# Altium schematic sheet 1_Battery.SchDoc
size A
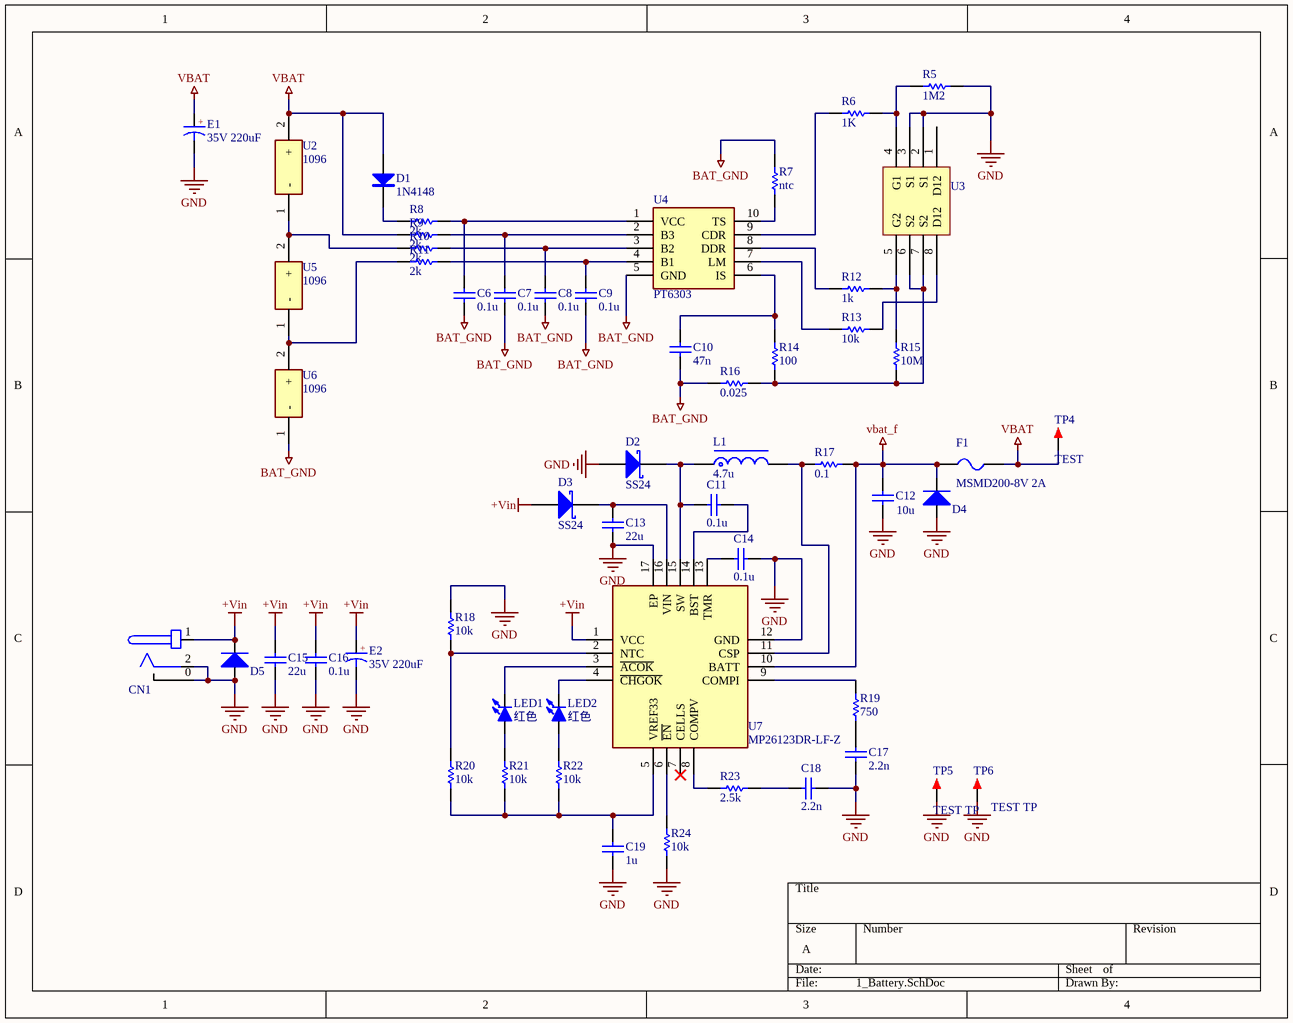
[diagram p0: 1_Battery.SchDoc]

## Parts
C6  0.1u  [CAP_0603_SMD]
C7  0.1u  [CAP_0603_SMD]
C8  0.1u  [CAP_0603_SMD]
C9  0.1u  [CAP_0603_SMD]
C10  47n  [CAP_0603_SMD]
C11  0.1u  [CAP_0603_SMD]
C12  10u  [C1206_L]
C13  22u  [C1812_L]
C14  0.1u  [CAP_0603_SMD]
C15  22u  [C1812_L]
C16  0.1u  [CAP_0603_SMD]
C17  2.2n  [CAP_0603_SMD]
C18  2.2n  [CAP_0603_SMD]
C19  1u  [CAP_0603_SMD]
CN1  PWR5.5x2.1_HP  [PWR5.5x2.1_HP]  (value not drawn)
D1  1N4148  [SOD-323]
D2  SS24  [SMB]
D3  SS24  [SMB]
D4  TVS  [SMA]  (value not drawn)
D5  TVS  [SMA]  (value not drawn)
E1  35V 220uF  [CE E(8*10.2)]
E2  35V 220uF  [CE E(8*10.2)]
F1  MSMD200-8V 2A  [FU 1812]
L1  4.7u  [L-SMD-0630]
LED1  红色  [LED0603_Y]
LED2  红色  [LED0603_Y]
R5  1M2  [RES_0603_SMD]
R6  1K  [RES_0603_SMD]
R7  ntc  [RES_0603_SMD]
R8  2k  [RES_0603_SMD]
R9  2k  [RES_0603_SMD]
R10  2k  [RES_0603_SMD]
R11  2k  [RES_0603_SMD]
R12  1k  [RES_0603_SMD]
R13  10k  [RES_0603_SMD]
R14  100  [RES_0603_SMD]
R15  10M  [RES_0603_SMD]
R16  0.025  [RES_1206_SMD]
R17  0.1  [RES_1206_SMD]
R18  10k  [RES_0603_SMD]
R19  750  [RES_0603_SMD]
R20  10k  [RES_0603_SMD]
R21  10k  [RES_0603_SMD]
R22  10k  [RES_0603_SMD]
R23  2.5k  [RES_0603_SMD]
R24  10k  [RES_0603_SMD]
TP4  TEST  [TEST 1.2]
TP5  TEST TP  [TEST TP1.4_BK]
TP6  TEST TP  [TEST TP1.4_BK]
U2  1096  [1096]
U3  FS8205A TSSOP-8  [IC_TSSOP-8]  (value not drawn)
U4  PT6303  [SOP50P490X110-10N]
U5  1096  [1096]
U6  1096  [1096]
U7  MP26123DR-LF-Z  [QFN65P400X400X100-17N-D]

## Nets
+Vin: C15.2 C16.2 CN1.1(+) D3.1(A) D5.2(K) E2.1 U7.1(VCC)
BAT_GND: C6.2 C7.2 C8.2 C9.2 C10.2 R7.1 R16.1 U4.5(GND) U6.1(-)
GND: C12.1 C13.1 C14.2 C15.1 C16.1 C17.1 C18.1 C19.2 CN1.0(SHIELD) CN1.2(GND) D2.1(A) D4.1(A) D5.1(A) E1.2 E2.2 R5.1 R18.2 R24.2 TP5.1 TP6.1 U3.2(S1) U3.3(S1) U7.12(GND) U7.17(EP)
VBAT: D1.1(A) E1.1 F1.2 R9.2 TP4.1 U2.2(+)
vbat_f: C12.2 D4.2(K) F1.1 R17.2 U7.10(BATT)
NetC6_1: C6.1 R8.1 U4.1(VCC)
NetC7_1: C7.1 R9.1 U4.2(B3)
NetC8_1: C8.1 R10.1 U4.3(B2)
NetC9_1: C9.1 R11.1 U4.4(B1)
NetC10_1: C10.1 R14.1 U4.6(IS)
NetC11_1: C11.1 D2.2(K) L1.1 U7.15(SW)
NetC11_2: C11.2 U7.14(BST)
NetC13_2: C13.2 D3.2(K) U7.16(VIN)
NetC14_1: C14.1 U7.13(TMR)
NetC17_2: C17.2 R19.2
NetC18_2: C18.2 R23.1
NetC19_1: C19.1 R20.1 R21.1 R22.1 U7.5(VREF33)
NetD1_2: D1.2(K) R8.2
NetL1_2: L1.2 R17.1 U7.11(CSP)
NetLED1_1: LED1.1(A) R21.2
NetLED1_2: LED1.2(K) U7.3(~{ACOK})
NetLED2_1: LED2.1(A) R22.2
NetLED2_2: LED2.2(K) U7.4(~{CHGOK})
NetR5_2: R5.2 R6.1 U3.4(G1)
NetR6_2: R6.2 U4.9(CDR)
NetR7_2: R7.2 U4.10(TS)
NetR10_2: R10.2 U2.1(-) U5.2(+)
NetR11_2: R11.2 U5.1(-) U6.2(+)
NetR12_1: R12.1 R15.1 U3.5(G2)
NetR12_2: R12.2 U4.8(DDR)
NetR13_1: R13.1 U3.8(D12)
NetR13_2: R13.2 U4.7(LM)
NetR14_2: R14.2 R15.2 R16.2 U3.6(S2) U3.7(S2)
NetR18_1: R18.1 R20.2 U7.2(NTC)
NetR19_1: R19.1 U7.9(COMPI)
NetR23_2: R23.2 U7.8(COMPV)
NetR24_1: R24.1 U7.6(~{EN})

Not connected (* = marked no-connect by the designer): U3 1(D12); U7 7(CELLS)*

## Notes on the sheet
- (in symbol CE_SMD) +

## Library data of the parts
C6-C11 C14 C16-C19 = CAP_0603_SMD: Capacitor, 0603, SMD; Published: 8-Jun-2000; LatestRevisionDate: 17-Jul-2002; LatestRevisionNote: Re-released for DXP Platform.; PackageReference: RAD-0.3; Publisher: Altium Limited
C12 C13 C15 = C: 贴片电容; BOM名称: 无极性贴片电容; 联系卖家，免费查找封装: 唯一出售店铺网址https://shop463601444.taobao.com; 封装库来自淘宝卖家ID：黄晶宝石: 其他店铺购入均为盗版假冒封装库，请立即申请退款
CN1 = PWR5.5x2.1_HP: DC Socket, 5.5x2.1, High-power
D1 = 1N4148: 开关二极管; BOM名称: 高速开关二极管; 联系卖家，免费查找封装: 唯一出售店铺网址https://shop463601444.taobao.com
D2 D3 = SS24: 肖特基二极管; 属性: 40V/2A; 联系卖家，免费查找封装: 唯一出售店铺网址https://shop463601444.taobao.com; BOM名称: 肖特基二极管
D4 D5 = TVS: TVS通用; 联系卖家，免费查找封装: 唯一出售店铺网址https://shop463601444.taobao.com; Code_JEDEC: DO-214-AB
E1 E2 = CE_SMD: 贴片电解电容; 联系卖家，免费查找封装: 唯一出售店铺网址https://shop463601444.taobao.com; 封装库来自淘宝卖家ID：黄晶宝石: 其他店铺购入均为盗版假冒封装库，请立即申请退款; BOM名称: 贴片电解电容
F1 = FU: 贴片保险丝; 联系卖家，免费查找封装: 唯一出售店铺网址https://shop463601444.taobao.com; BOM名称: 贴片保险丝
L1 = L-Molding Choke: 一体成型电感; 联系卖家，免费查找封装: 唯一出售店铺网址https://shop463601444.taobao.com; 封装库来自淘宝卖家ID：黄晶宝石: 其他店铺购入均为盗版假冒封装库，请立即申请退款; BOM名称: 一体成型电感
LED1 LED2 = LED-SMD: 贴片LED; 封装库来自淘宝卖家 ID：黄晶宝石: 其他店铺购入均为假冒，请立即申请退款，本店奖励现金5~20元; BOM名称: 贴片LED
R5-R15 R18-R24 = RES_0603_SMD: Resistor, 0603, SMD; Published: 8-Jun-2000; LatestRevisionDate: 17-Jul-2002; LatestRevisionNote: Re-released for DXP Platform.; PackageReference: AXIAL-0.3; Publisher: Altium Limited; Value: Value
R16 R17 = RES_1206_SMD: Resistor, 1206, SMD; Published: 8-Jun-2000; LatestRevisionDate: 17-Jul-2002; LatestRevisionNote: Re-released for DXP Platform.; PackageReference: AXIAL-0.3; Publisher: Altium Limited; Value: Value
TP4 = TEST: 测试点; 联系卖家，免费查找封装: 唯一出售店铺网址https://shop463601444.taobao.com; BOM名称: 测试点
TP5 TP6 = TEST TP: 测试环; 联系卖家，免费查找封装: 唯一出售店铺网址https://shop463601444.taobao.com; BOM名称: 测试环
U2 U5 U6 = 1096: Undefined or Miscellaneous; Manufacturer_Name: Keystone Electronics; Datasheet Link: http://www.keyelco.com/product-pdf.cfm?p=14034; Height: 14.86mm; Manufacturer_Part_Number: 1096; Mouser Part Number: 534-1096; Mouser Price/Stock: https://www.mouser.co.uk/ProductDetail/Keystone-Electronics/1096?qs=lpFmnCe%2FWT9bsXx2ZUVLWQ%3D%3D
U3 = FS8205A TSSOP-8: Dual N-Channel Enhancement Mode Power MOSFET
U4 = PT6303: Integrated Circuit; Datasheet Link: http://www.analog.com/media/en/technical-documentation/data-sheets/AD4001-4005.pdf; Height: 1.1mm; Arrow Part Number: AD4001BRMZ; Arrow Price/Stock: https://www.arrow.com/en/products/ad4001brmz/analog-devices
U7 = MP26123DR-LF-Z: Integrated Circuit; Manufacturer_Name: Monolithic Power Systems (MPS); Datasheet Link: https://www.monolithicpower.com/pub/media/document/MP26123_r1.01.pdf; Height: 1mm; Manufacturer_Part_Number: MP26123DR-LF-Z; Mouser Part Number: 946-MP26123DRLFZ; Mouser Price/Stock: https://www.mouser.co.uk/ProductDetail/Monolithic-Power-Systems-MPS/MP26123DR-LF-Z?qs=ddTkeYFZflVgOJRHHyrLxQ%3D%3D